# Altium schematic sheet Main.SchDoc
size A3; SheetNumber: 1; SheetTotal: 1
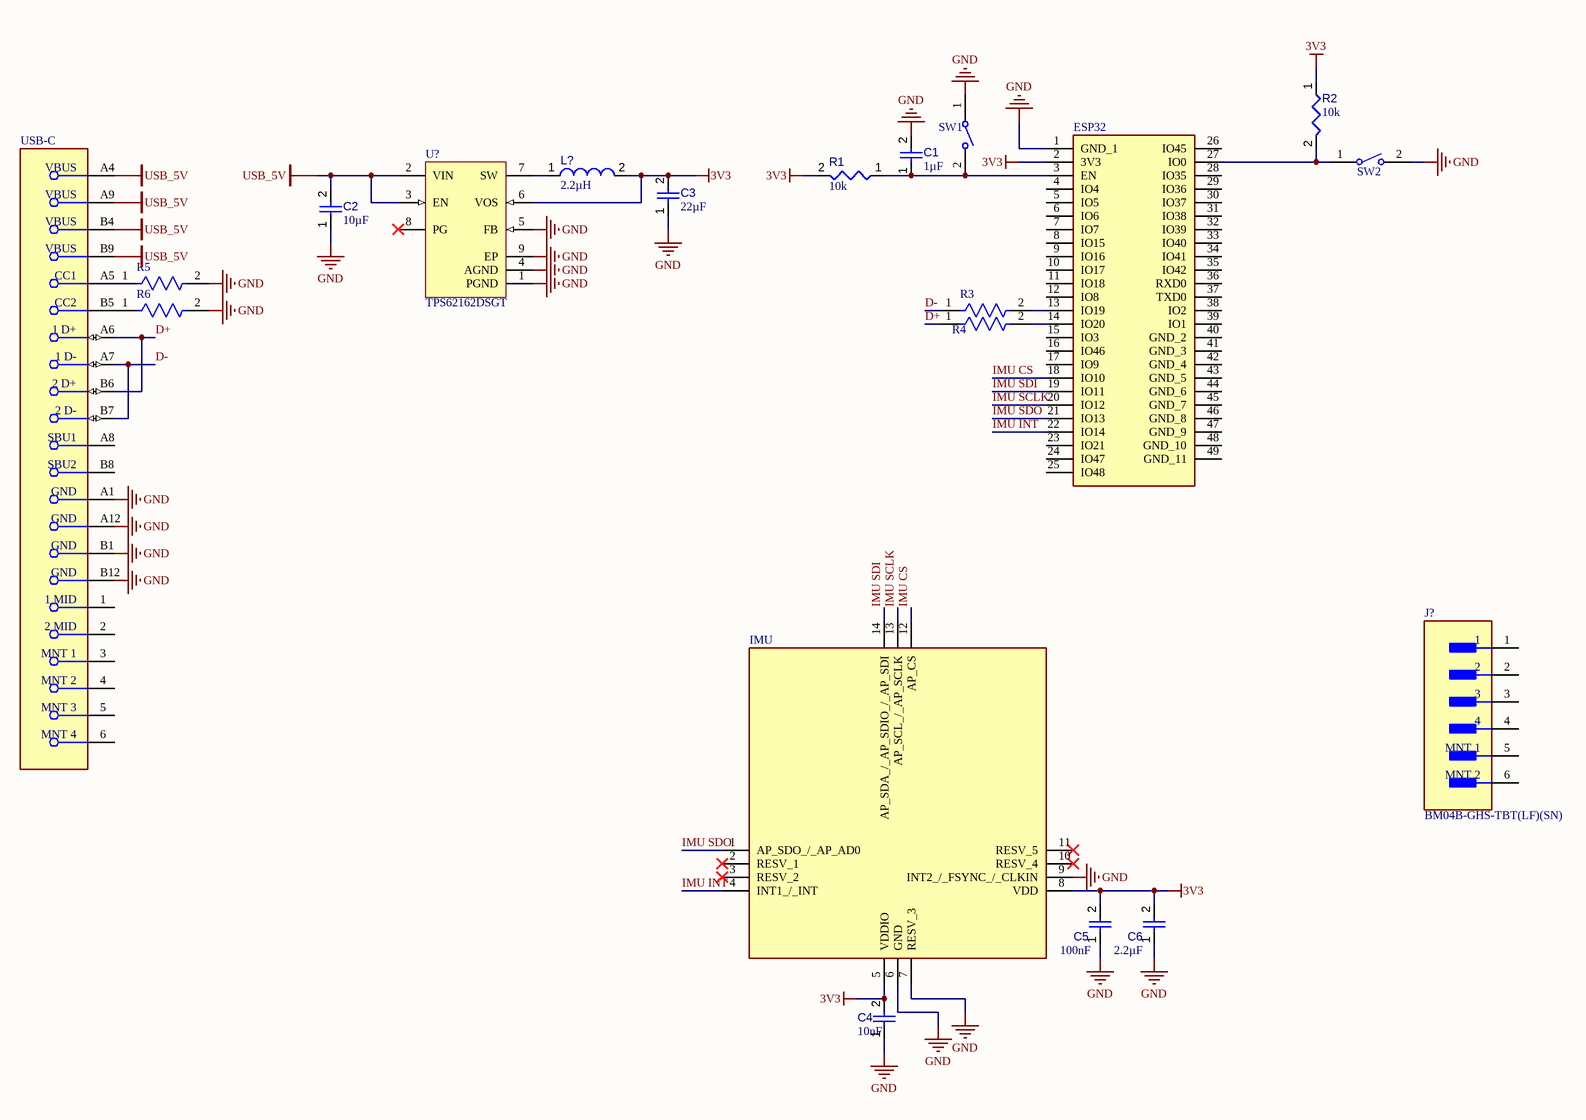
[diagram p0: Main.SchDoc]

## Parts
C1  value 1µF  [CAPC1608X90X35ML15T15]  (hidden comment: Capacitor 1uF +/- 10% 16V 0603)
C2  value 10µF  [CAPC2013X135X45NL10T25]  (hidden comment: Capacitor 10 uF +/- 10% 16 V 0805)
C3  value 22µF  [CAPC0805(2012)145_L]  (hidden comment: Capacitor 22µF +/-40% 16V 0805)
C4  value 10nF  [CAPC0402(1005)60_L]  (hidden comment: Capacitor 10nF +/-20% 50V 0402)
C5  value 100nF  [CAPC1608X90X40NL10T20]  (hidden comment: Capacitor 100 nF +/-10% 50 V 0603)
C6  value 2.2µF  [CAPC0402(1005)60_L]  (hidden comment: Capacitor 2,2µF +/-20% 10V 0402)
ESP32  ESP32-S3-WROOM-1-N8  [ESP32S3WROOM1N8R2]  (value not drawn)
IMU  ICM-42688-P  [IIM42352]  (value not drawn)
J?  BM04B-GHS-TBT(LF)(SN)  [FP-BM04B-GHS-TBT_LF_SN-MFG]
L?  value 2.2µH  [IND1005X55X20VL5T10]  (hidden comment: ELJ-RF2N2DFB)
R1  value 10k  [RESC1608X55X25ML10T15]  (hidden comment: Resistor 10k +/-1% 0603 100 mW)
R2  value 10k  [RESC1608X55X25ML10T15]  (hidden comment: Resistor 10k +/-1% 0603 100 mW)
R3  22  [FP-SR0603-MFG]  (value not drawn)
R4  SR0603FR-7T22RL  [FP-SR0603-MFG]  (value not drawn)
R5  AC0603FR-075K1L  [FP-AC0603-MFG]  (value not drawn)
R6  AC0603FR-075K1L  [FP-AC0603-MFG]  (value not drawn)
SW1  2-1825027-0  [TECO-2-1825027-0_V]  (value not drawn)
SW2  2-1825027-0  [TECO-2-1825027-0_V]  (value not drawn)
U?  TPS62162DSGT  [DSG0008A_V]
USB-C  CX90M-16P  [FP-CX90M-16P-MFG]  (value not drawn)

## Nets
3V3: C3.2 C4.2 C5.2 C6.2 ESP32.2(3V3) IMU.5(VDDIO) IMU.8(VDD) L?.2 R1.2 R2.1 U?.6(VOS)
GND: C1.2 C2.1 C3.1 C4.1 C5.1 C6.1 ESP32.1(GND_1) IMU.6(GND) IMU.7(RESV_3) IMU.9(INT2_/_FSYNC_/_CLKIN) R5.2 R6.2 SW1.1 SW2.2 U?.1(PGND) U?.4(AGND) U?.5(FB) U?.9(EP) USB-C.A1(GND) USB-C.A12(GND) USB-C.B1(GND) USB-C.B12(GND)
USB_5V: C2.2 U?.2(VIN) U?.3(EN) USB-C.A4(VBUS) USB-C.A9(VBUS) USB-C.B4(VBUS) USB-C.B9(VBUS)
D+: R4.1 USB-C.A6(1_D+) USB-C.B6(2_D+)
D-: R3.1 USB-C.A7(1_D-) USB-C.B7(2_D-)
IMU CS: ESP32.18(IO10) IMU.12(AP_CS)
IMU INT: ESP32.22(IO14) IMU.4(INT1_/_INT)
IMU SCLK: ESP32.20(IO12) IMU.13(AP_SCL_/_AP_SCLK)
IMU SDI: ESP32.19(IO11) IMU.14(AP_SDA_/_AP_SDIO_/_AP_SDI)
IMU SDO: ESP32.21(IO13) IMU.1(AP_SDO_/_AP_AD0)
NetC1_1: C1.1 ESP32.3(EN) R1.1 SW1.2
NetESP32_13: ESP32.13(IO19) R3.2
NetESP32_14: ESP32.14(IO20) R4.2
NetESP32_27: ESP32.27(IO0) R2.2 SW2.1
NetL?_1: L?.1 U?.7(SW)
NetR5_1: R5.1 USB-C.A5(CC1)
NetR6_1: R6.1 USB-C.B5(CC2)

Not connected (* = marked no-connect by the designer): ESP32 4(IO4) 5(IO5) 6(IO6) 7(IO7) 8(IO15) 9(IO16) 10(IO17) 11(IO18) 12(IO8) 15(IO3) 16(IO46) 17(IO9) 23(IO21) 24(IO47) 25(IO48) 26(IO45) 28(IO35) 29(IO36) 30(IO37) 31(IO38) 32(IO39) 33(IO40) 34(IO41) 35(IO42) 36(RXD0) 37(TXD0) 38(IO2) 39(IO1) 40(GND_2) 41(GND_3) 42(GND_4) 43(GND_5) 44(GND_6) 45(GND_7) 46(GND_8) 47(GND_9) 48(GND_10) 49(GND_11); IMU 2(RESV_1)* 3(RESV_2)* 10(RESV_4)* 11(RESV_5)*; J? 1 2 3 4 5(MNT_1) 6(MNT_2); U? 8(PG)*; USB-C 1(1_MID) 2(2_MID) 3(MNT_1) 4(MNT_2) 5(MNT_3) 6(MNT_4) A8(SBU1) B8(SBU2)

## Library data of the parts
C1 = CMP-001-00004-6: Chip Capacitor, 1 uF, +/- 10%, 16 V, 0603 (1608 Metric); Capacitor Type: Ceramic; Mounting Technology: SM; RoHS Compliant: True; Min Operating Temperature: -55°C; Case/Package: 0603; Pins: 2; Voltage Rating: 16V; Max Operating Temperature: 125°C; Tolerance: 10%
C2 = CMP-001-00015-6: Chip Capacitor, 10 uF, +/- 10%, 16 V, 0805 (2012 Metric); Voltage Rating: 16V; Capacitor Type: Ceramic; RoHS Compliant: True; Max Operating Temperature: 85°C; Min Operating Temperature: -55°C; Mounting Technology: SM; Tolerance: 10%; Case/Package: 0805; Pins: 2
C3 = CMP-001-00081-4: Chip Capacitor, 22µF +/-40%, 16V, 0805, Thickness 1.45 mm; Tolerance: 5%; Voltage Rating: 16V; Mounting Technology: SMT; Pins: 2; Max Operating Temperature: 85°C; Case/Package: 0805; Min Operating Temperature: -55°C
C4 = CMP-001-00069-3: Chip Capacitor, 10nF +/-20%, 50V, 0402, Thickness 0.6 mm; Tolerance: 5%; Max Operating Temperature: 85°C; Pins: 2; Case/Package: 0402; Voltage Rating: 50V; Min Operating Temperature: -55°C; Mounting Technology: SMT
C5 = CMP-001-00017-6: Chip Capacitor, 100 nF, +/- 10%, 50 V, 0603 (1608 Metric); Voltage Rating: 50V; Capacitor Type: Ceramic; Tolerance: 10%; Mounting Technology: SM; Max Operating Temperature: 125°C; RoHS Compliant: True; Pins: 2; Case/Package: 0603; Min Operating Temperature: -55°C
C6 = CMP-001-00056-4: Chip Capacitor, 2,2µF +/-20%, 10V, 0402, Thickness 0.6 mm; Tolerance: 10%; Mounting Technology: SMT; Max Operating Temperature: 85°C; Case/Package: 0402; Pins: 2; Min Operating Temperature: -55°C; Voltage Rating: 10V
ESP32 = ESP32-S3-WROOM-1-N8: Integrated Circuit; Manufacturer_Name: Espressif Systems; Datasheet Link: https://www.espressif.com/sites/default/files/documentation/esp32-s3-wroom-1_wroom-1u_datasheet_en.pdf; Height: 3.25mm; Manufacturer_Part_Number: ESP32-S3-WROOM-1-N8; Mouser Part Number: 356-ESP32-S3WROOM1N8; Mouser Price/Stock: https://www.mouser.co.uk/ProductDetail/Espressif-Systems/ESP32-S3-WROOM-1-N8?qs=Wj%2FVkw3K%252BMC1mq0KGPvoSQ%3D%3D
IMU = ICM-42688-P: Integrated Circuit; Manufacturer_Name: TDK; Datasheet Link: https://3cfeqx1hf82y3xcoull08ihx-wpengine.netdna-ssl.com/wp-content/uploads/2021/06/DS-000347-ICM-42688-P-v1.5.pdf; Manufacturer_Part_Number: ICM-42688-P; Mouser Part Number: 410-ICM-42688-P; Mouser Price/Stock: https://www.mouser.co.uk/ProductDetail/TDK-InvenSense/ICM-42688-P?qs=OlC7AqGiEDk8QrNAV728zw%3D%3D; Arrow Part Number: ICM-42688-P; Arrow Price/Stock: https://www.arrow.com/en/products/icm-42688-p_2/invensense.html?utm_currency=USD&region=nac
J? = CMP-17439-000062-2: CONN HEADER SMD 4POS 1.25MM; Number of Positions: 4; Wire/Cable Gauge: 26AWG; Current Rating: 1A; Voltage Rating (AC): 50V; Gender: Male; Orientation: Straight; Max Operating Temperature: 85°C; Pitch: 1.25mm; Contact Plating: Tin; Number of Rows: 4; Series: GH; Min Operating Temperature: -25°C; REACH SVHC: No SVHC; Packaging: Cut Tape; Lead Free: Lead Free; Voltage Rating: 50V; Contact Material: Bronze; Number of Contacts: 4; Termination: Crimp; Case/Package: SMD/SMT; Housing Color: Natural; Housing Material: Nylon
L? = CMP-006-00006-6: Chip Inductor, 2.2 nH, +/- 0.3 nH, 400 mA, -40 to 85 degC, 0402 (1005 Metric), RoHS, Tape and Reel; Manufacturer: Panasonic; Shielding: Unshielded; Current Rating: 400mA; Tolerance: 5%; Core Material: Ceramic; Q Factor: 8; Datasheet URL: http://www.bourns.com/docs/Product-Datasheets/cm322522.pdf; Case/Package: 0402; RoHS Compliant: True; Package Description: 2-Pin Surface Mount Device, Body 1 x 0.5 mm; Packaging: TapeandReel; Datasheet Version: Sep-12; Package Quantity: 10000; Package Reference: 0402; Min Operating Temperature: -20°C; Mounting Technology: SM; Max Operating Temperature: 85°C
R1 R2 = CMP-009-00017-5: Chip Resistor, 10 KOhm, +/- 1%, 01 W, -55 to 155 degC, 0603 (1608 Metric); Voltage Rating: 50V; Power: 100mW; RoHS Compliant: True; Min Operating Temperature: -55°C; Pins: 2; Case/Package: 0603; Mounting Technology: SM; Max Operating Temperature: 155°C; Tolerance: 1%
R3 = CMP-03412-021889-1: RES 22 OHM 1% 1/4W 0603; Manufacturer Part Number: SR0603FR-7T22RL; Manufacturer: Yageo; Resistance: 22Ω; Power Rating: 0.25W; Automotive Grade: Grade 0; Tolerance: 0.01; Voltage Rating: 75V; Value: 22Ω; Automotive: Yes; Device Class L1: Passive Components; Temperature Range Low: -55°C; Package: SR0603; Device Class L3: Chip SMD Resistors; Digikey Description: RES 22 OHM 1% 1/4W 0603; RoHS: TRUE; Device Class L2: Resistors; Height: 0.55mm; Ipc Land Pattern Name: RESC16080X45; Temperature Range High: +155°C; Temperature: -55°C to +155°C; Octopart: https://octopart.com/sr0603fr-7t22rl-yageo-91478080; Composition: Thick Film; Category: Res; ComponentLink2URL: http://www.yageo.com/documents/recent/PYu-SR_D_F%20tol_RoHS_L_3.pdf; Lead Free: Yes; Footprint Url: http://www.yageo.com/exep/pages/download/literatures/PYu-R_Mount_10.pdf; ComponentLink2Description: Datasheet; Series: SR
R4 = CMP-03412-021889-1: RES 22 OHM 1% 1/4W 0603; Manufacturer: Yageo; Resistance: 22Ω; Power Rating: 0.25W; Automotive Grade: Grade 0; Tolerance: 0.01; Voltage Rating: 75V; Value: 22Ω; Automotive: Yes; Manufacturer Part Number: SR0603FR-7T22RL; Device Class L1: Passive Components; Temperature Range Low: -55°C; Package: SR0603; Device Class L3: Chip SMD Resistors; Digikey Description: RES 22 OHM 1% 1/4W 0603; RoHS: TRUE; Device Class L2: Resistors; Height: 0.55mm; Ipc Land Pattern Name: RESC16080X45; Temperature Range High: +155°C; Temperature: -55°C to +155°C; Octopart: https://octopart.com/sr0603fr-7t22rl-yageo-91478080; Composition: Thick Film; Category: Res; ComponentLink2URL: http://www.yageo.com/documents/recent/PYu-SR_D_F%20tol_RoHS_L_3.pdf; Lead Free: Yes; Footprint Url: http://www.yageo.com/exep/pages/download/literatures/PYu-R_Mount_10.pdf; ComponentLink2Description: Datasheet; Series: SR
R5 R6 = CMP-03412-025080-2: RES 5.1KΩ 1.00% 0.1W 0603; Voltage Rating: 50V; Temperature Coefficient: 100ppm/°C; Resistance: 5.1kR; Max Power Dissipation: 100mW; Tolerance: 1%; Max Operating Temperature: 155°C; Min Operating Temperature: -55°C; Ratings: AEC-Q200; Features: Moisture Resistant; RoHS Compliant: Yes; Number of Terminations: 2; Weight: 7.1E-05oz; Case Code (Imperial): 0603; Resistor Type: Thick Film; Length: 1.6mm; Termination: SMD/SMT; Case Code (Metric): 1608; Packaging: Tape and Reel; Width: 0.8mm; Series: AC; Case/Package: 0603; Power Rating: 100mW; Height: 0.45mm
SW1 SW2 = CMP-2000-05529-1: Micro-Miniature Pushbutton Switch, 50 mA, -35 to 85 degC, 2-Pin THD, RoHS, Bulk; Manufacturer: TE Connectivity; Pole Throw Configuration: SPST; Body Orientation: RightAngle; Product Length (mm): 7.11mm; Voltage Rating (VDC): 24V; Current Rating (Max): 0.05A; Product Depth (mm): 10mm; Operating Force: 1.57N; Actuator Style: RoundButton; Illumination Type: NotRequired; Ground Terminal: No; Product Height (mm): 7.01mm; Actuator Color: Black; Switch Function Configuration: OFFON; Package Reference: 2-1825027-0; Terminal Type: PCPins; Contact Plating: Silver; Package Description: 2-Pin Through Hole Device, Body 15.86 x 7.11 mm, Pitch 4.5 mm; Mounting Style: ThroughHole; Manufacturer URL: http://www.te.com/; Datasheet URL: http://www.te.com/commerce/DocumentDelivery/DDEController?Action=showdoc&DocId=Customer+Drawing%7F1825027%7FG4%7Fpdf%7FEnglish%7FENG_CD_1825027_G4.pdf%7F2-1825027-0; Operating Temp Range: -35Cto85C; Packaging: TapeandReel; Datasheet Version: Rev. G4, 06/2011; Mounting Technology: ThroughHole; Contact Material: CopperAlloy; Type: Micro-Miniature
U? = CMP-0323-00319-3: Buck Step Down Regulator with 3 to 17 V Input and 3.3 V Output, -40 to 85 degC, 8-Pin WSON (DSG), Green (RoHS & no Sb/Br); Manufacturer: Texas Instruments; Synchronous Rectification: TRUE; Iq(Typ)(mA): 0.017; Switch Current Limit(Typ)(A): 1.8; Regulated Outputs(#): 1; Duty Cycle(Max)(%): 100; SubFamily: Step-Down Regulator; Preset Vout(V): 3.3; Rating: Catalog; Vin(Max)(V): 17; Vin(Min)(V): 3; ComponentLink2Description: Package Specification; PackageVersion: revB, Oct-2010; DatasheetVersion: SLVSAM2A; ComponentLink1Description: Datasheet; PackageDescription: 8-Pin Plastic Small Outline No-Lead, 2 x 2 x 0.8 mm Body, 0.5 mm Pitch, Exposed Pad; ComponentLink2URL: http://www.ti.com/litv/pdf/mpds308a; Code_JEDEC: MO-229; PartNumber: TPS62162DSGT; ComponentLink3URL: Samples URL:http://www.ti.com/product/tps54611#samples; Mounting Technology: Surface Mount; Eco-Plan: Green (RoHS & no Sb/Br); Vout(Min)(V): 3.3; PackageReference: DSG0008A; Topology: Buck; ComponentLink1URL: http://www.ti.com/general/docs/lit/getliterature.tsp?genericPartNumber=TPS62162&fileType=pdf; Vout(Max)(V): 3.3; Iout(Max)(A): 1; ComponentLink3Description: URL Link1
USB-C = CMP-11601-000005-1: CONN RCPT USB2.0 TYPEC 16POS SMD; Connector Type: USB; Current Rating: 1.25A; Mating Cycles: 10000; Number of Contacts: 16; Gender: Receptacle; Shielding: Shielded; Number of Ports: 1; Insulation Color: Black; Termination: Solder; Min Operating Temperature: -30°C; Flammability Rating: UL94 V-0; Max Operating Temperature: 85°C; Packaging: Cut Tape; Contact Plating: Gold; Mount: Surface Mount